# Altium schematic sheet Sheet1.SchDoc
size A4; SheetNumber: 1; SheetTotal: 1
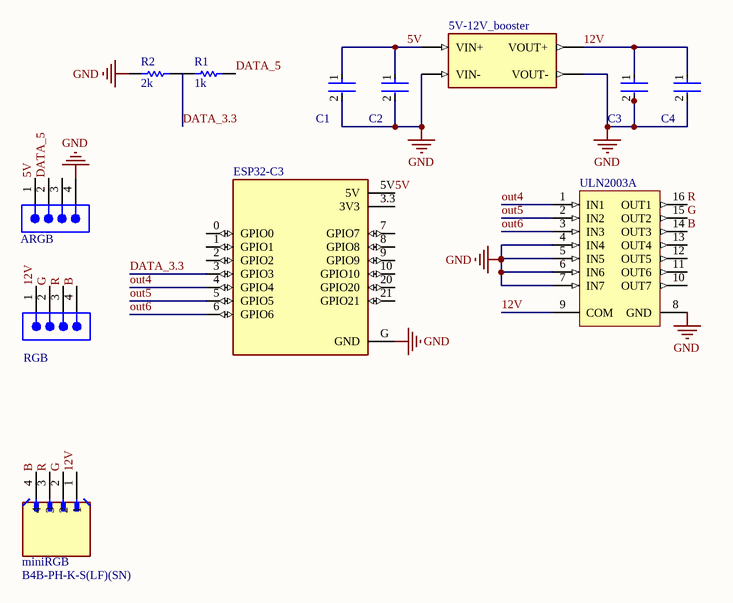
[diagram p0: Sheet1.SchDoc]

## Parts
5V-12V_booster  MT3608_DC-DC_STEP_UP_CONVERTER_2A_BOOSTER_MODULE  [MODULE_MT3608_DC-DC_STEP_UP_CONVERTER_2A_BOOSTER_MODULE]  (value not drawn)
ARGB  TSW-104-08-T-S  [SMTC-TSW-104-08-X-S]  (value not drawn)
C1  200nF  [FP-RDE2M1-MFG]  (value not drawn)
C2  200nF  [FP-RDE2M1-MFG]  (value not drawn)
C3  200nF  [FP-RDE2M1-MFG]  (value not drawn)
C4  200nF  [FP-RDE2M1-MFG]  (value not drawn)
ESP32-C3  ESP32-C3_SUPERMINI_SMD  [MODULE_ESP32-C3_SUPERMINI]  (value not drawn)
miniRGB  B4B-PH-K-S(LF)(SN)  [JST_B4B-PH-K-S(LF)(SN)]
R1  value 1k  [AXIAL-0.3]
R2  value 2k  [AXIAL-0.3]
RGB  ARGB  [SMTC-TSW-104-08-X-S]  (value not drawn)
ULN2003A  ULN2003A  [STM-DIP-16L]  (value not drawn)

## Nets
GND: 5V-12V_booster.VIN_N(VIN-) 5V-12V_booster.VOUT_N(VOUT-) ARGB.4 C1.2 C2.2 C3.2 C4.2 ESP32-C3.G(GND) R2.2 ULN2003A.4(IN4) ULN2003A.5(IN5) ULN2003A.6(IN6) ULN2003A.7(IN7) ULN2003A.8(GND)
5V: 5V-12V_booster.VIN_P(VIN+) ARGB.1 C1.1 C2.1 ESP32-C3.5V
12V: 5V-12V_booster.VOUT_P(VOUT+) C3.1 C4.1 miniRGB.1 RGB.1 ULN2003A.9(COM)
B: miniRGB.4 RGB.4 ULN2003A.14(OUT3)
DATA_3.3: ESP32-C3.3(GPIO3) R2.1
DATA_5: ARGB.2 R1.1
G: miniRGB.2 RGB.2 ULN2003A.15(OUT2)
out4: ESP32-C3.4(GPIO4) ULN2003A.1(IN1)
out5: ESP32-C3.5(GPIO5) ULN2003A.2(IN2)
out6: ESP32-C3.6(GPIO6) ULN2003A.3(IN3)
R: miniRGB.3 RGB.3 ULN2003A.16(OUT1)

Not connected (* = marked no-connect by the designer): ARGB 3; ESP32-C3 0(GPIO0) 1(GPIO1) 2(GPIO2) 3.3(3V3) 7(GPIO7) 8(GPIO8) 9(GPIO9) 10(GPIO10) 20(GPIO20) 21(GPIO21); R1 2; ULN2003A 10(OUT7) 11(OUT6) 12(OUT5) 13(OUT4)

## Library data of the parts
5V-12V_booster = MT3608_DC-DC_STEP_UP_CONVERTER_2A_BOOSTER_MODULE: MT3608-based step-up converter boosts 2Vâ€“24V input to 28V with up to 93% efficiency. Suitable for devices needing higher voltage than the source.; MF: Generic; MP: MT3608 DC-DC Step Up Converter 2A Booster Module; SnapEDA_Link: https://www.snapeda.com/parts/MT3608%20DC-DC%20Step%20Up%20Converter%202A%20Booster%20Module/Generic/view-part/?ref=snap; Package: Package; Value: *; Check_prices: https://www.snapeda.com/parts/MT3608%20DC-DC%20Step%20Up%20Converter%202A%20Booster%20Module/Generic/view-part/?ref=eda
ARGB = CMP-1024-00356-1: 0.025" SQ Post Header, Through-hole, Vertical, -55 to 105 degC, 2.54 mm Pitch, 4-Pin, Male, RoHS; Manufacturer: Samtec; Pitch: 2.54 mm; PackageDescription: .025[0.64] SQ. Post Terminal Strip Assembly; ComponentLink2URL: http://www.samtec.com/documents/webfiles/pdf/TSW_TH.PDF; ComponentLink3URL: http://www.samtec.com/documents/webfiles/cpdf/TSW-XXX-XX-XXX-X-XX-XXX-MKT.pdf; PackageVersion: DM, 8/1988; ComponentLink3Description: Package Specification; DatasheetVersion: F-214; Orientation: Vertical; RoHS: True; Mounting Technology: Through-hole; ComponentLink1URL: http://www.samtec.com; PartNumber: TSW-104-08-T-S; ComponentLink1Description: Manufacturer URL; Temperature Range: -55 to 105 degC; ComponentLink2Description: Datasheet; PackageReference: TSW-104-08-X-S
C1-C4 = CMP-06035-028300-1: Ceramic Capacitor 10nF ±10% 630V X7R Radial; Lead Diameter: 0.5mm; Lead/Base Style: Formed Leads; Width: 4mm; Resistor Type: Ceramic; Lead Free: Lead Free; Case/Package: Radial; Voltage Rating: 630V; Dielectric: X7R; Mount: Through Hole; Capacitance: 10nF; Voltage Rating (DC): 630V; Length: 0.217inch; Max Operating Temperature: 125°C; Min Operating Temperature: -55°C; Packaging: Tape and Reel; Height: 4mm; Package Quantity: 2000; Termination: Radial; Lead Pitch: 0.197inch; Tolerance: 10%; Height - Seated (Max): 0.236inch
ESP32-C3 = ESP32-C3_SUPERMINI_SMD: Super tiny ESP32-C3 board; MF: Espressif Systems; MP: ESP32-C3 SuperMini_SMD; SnapEDA_Link: https://www.snapeda.com/parts/ESP32-C3%20SuperMini_SMD/Espressif+Systems/view-part/?ref=snap; Package: None; Value: *; Check_prices: https://www.snapeda.com/parts/ESP32-C3%20SuperMini_SMD/Espressif+Systems/view-part/?ref=eda
miniRGB = B4B-PH-K-S(LF)(SN): Connector Header Through Hole 4 position 0.079 (2.00mm); MF: JST Sales; SnapEDA_Link: https://www.snapeda.com/parts/B4B-PH-K-S%20(LF)(SN)/JST/view-part/?ref=snap; Package: None; Value: *; MP: B4B-PH-K-S (LF)(SN); Check_prices: https://www.snapeda.com/parts/B4B-PH-K-S%20(LF)(SN)/JST/view-part/?ref=eda
R1 R2 = Res1: Resistor; Published: 8-Jun-2000; LatestRevisionDate: 17-Jul-2002; LatestRevisionNote: Re-released for DXP Platform.; PackageReference: AXIAL-0.3; Publisher: Altium Limited; PackageDescription: Axial Device, Thru-Hole; 2 Leads; 0.3 in Pin Spacing
RGB = CMP-1024-00356-1: 0.025" SQ Post Header, Through-hole, Vertical, -55 to 105 degC, 2.54 mm Pitch, 4-Pin, Male, RoHS; PartNumber: TSW-104-08-T-S; Manufacturer: Samtec; Pitch: 2.54 mm; PackageDescription: .025[0.64] SQ. Post Terminal Strip Assembly; ComponentLink2URL: http://www.samtec.com/documents/webfiles/pdf/TSW_TH.PDF; ComponentLink3URL: http://www.samtec.com/documents/webfiles/cpdf/TSW-XXX-XX-XXX-X-XX-XXX-MKT.pdf; PackageVersion: DM, 8/1988; ComponentLink3Description: Package Specification; DatasheetVersion: F-214; Orientation: Vertical; RoHS: True; Mounting Technology: Through-hole; ComponentLink1URL: http://www.samtec.com; ComponentLink1Description: Manufacturer URL; Temperature Range: -55 to 105 degC; ComponentLink2Description: Datasheet; PackageReference: TSW-104-08-X-S
ULN2003A = CMP-2000-07351-1: Seven Darlington Array, 50 V, 0.5 A, -40 to 85 degC, 16-Pin DIP, RoHS, Tube; Manufacturer: STMicroelectronics; Transistor Polarity: NPN; VOUT: 50V; No. of Pins: 16Pins; SVHC: NoSVHC(17-Dec-2015); DC Current Gain hFE: 1000hFE; Output Current: 0.5A; DC Collector Current: 500mA; Transistor Case Style: DIP; Package Reference: DIP-16L; Automotive Qualification Standard: -; Mounting Technology: ThroughHole; Power Dissipation Pd: -; Collector Emitter Voltage V(br)ceo: 50V; Datasheet URL: http://www2.st.com/content/ccc/resource/technical/document/datasheet/f3/6e/c8/64/4d/b3/4e/38/CD00001244.pdf/files/CD00001244.pdf/jcr:content/translations/en.CD00001244.pdf; Manufacturer URL: http://www.st.com/; PartNumber: ULN2003A; MSL: MSL2-1year; Product Range: -; Package Description: 16-Pin DIP, Body 19.7 x 7.1 mm, Pitch 2.54 mm; Operating Temperature Max: 85°C; Datasheet Version: Rev. 8, 06/2012